# EAGLE design hover (EAGLE 8.3.2)
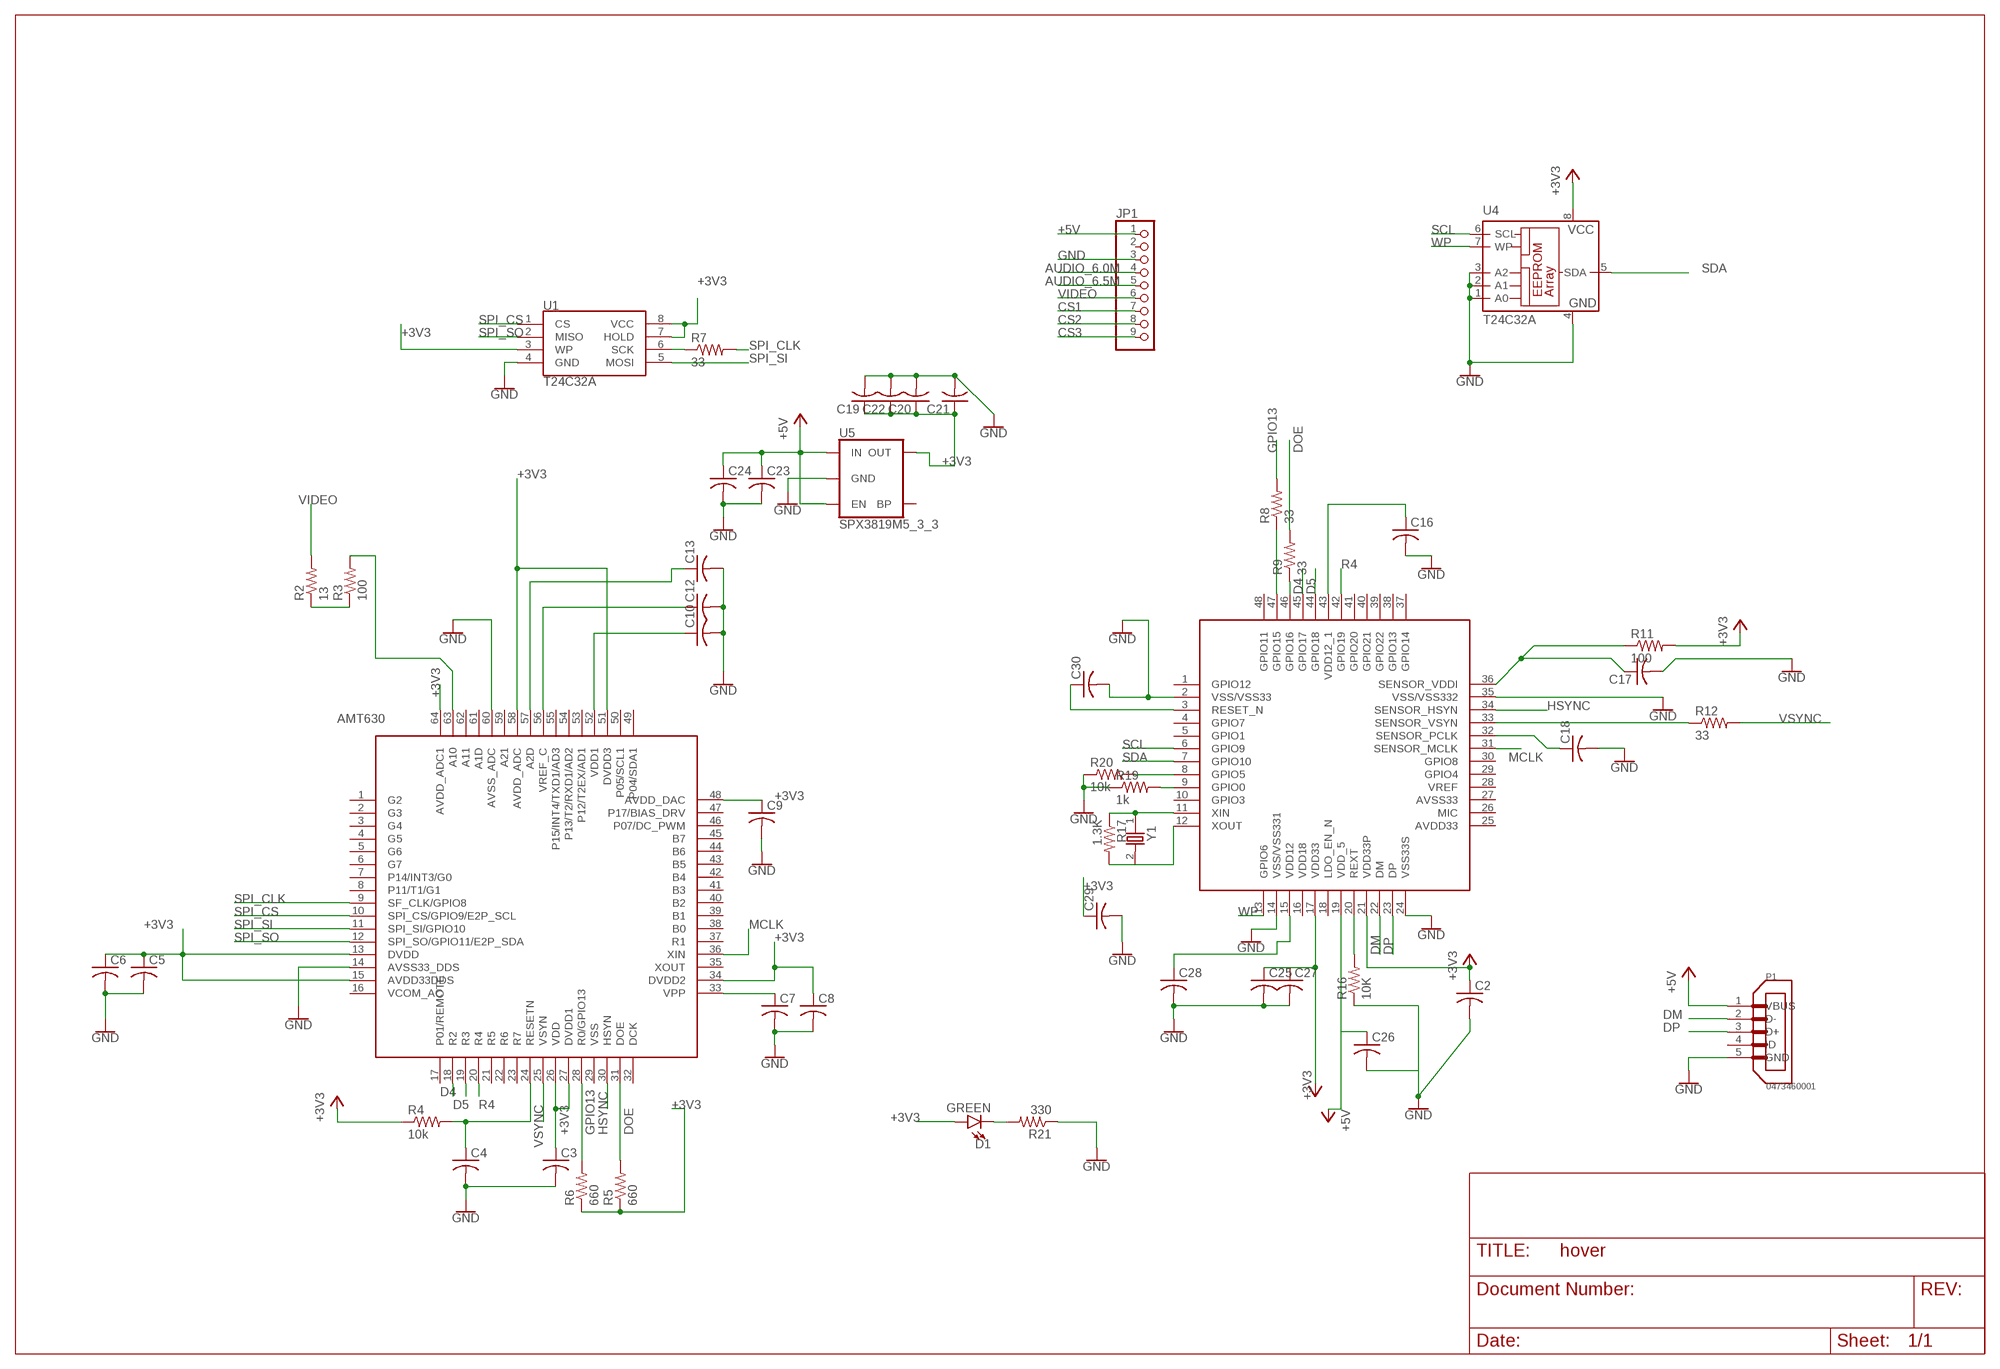
[diagram p0: schematic, sheet 1]

## Parts
C2  C-USC0402  [C0402]
C3  C-USC0402  [C0402]
C4  C-USC0402  [C0402]
C5  C-USC0402  [C0402]
C6  C-USC0402  [C0402]
C7  C-USC0402  [C0402]
C8  C-USC0402  [C0402]
C9  C-USC0402  [C0402]
C10  C-USC0402  [C0402]
C12  C-USC0402  [C0402]
C13  C-USC0402  [C0402]
C16  C-USC0402  [C0402]
C17  C-USC0402  [C0402]
C18  C-USC0402  [C0402]
C19  C-USC0402  [C0402]
C20  C-USC0402  [C0402]
C21  C-USC0402  [C0402]
C22  C-USC0402  [C0402]
C23  C-USC0402  [C0402]
C24  C-USC0402  [C0402]
C25  C-USC0402  [C0402]
C26  C-USC0402  [C0402]
C27  C-USC0402  [C0402]
C28  C-USC0402  [C0402]
C29  C-USC0402  [C0402]
C30  C-USC0402  [C0402]
D1  GREEN  LED-GREEN0603  [LED-0603]
JP1  PINHD-1X9  [1X09-BIG]
P1  0473460001  [MOLEX_0473460001]
R2  13  R-US_R0402  [R0402]
R3  100  R-US_R0402  [R0402]
R4  10k  R-US_R0402  [R0402]
R5  660  R-US_R0402  [R0402]
R6  660  R-US_R0402  [R0402]
R7  33  R-US_R0402  [R0402]
R8  33  R-US_R0402  [R0402]
R9  33  R-US_R0402  [R0402]
R11  100  R-US_R0402  [R0402]
R12  33  R-US_R0402  [R0402]
R16  10K  R-US_R0402  [R0402]
R17  1.3K  R-US_R0402  [R0402]
R19  1k  R-US_R0402  [R0402]
R20  10k  R-US_R0402  [R0402]
R21  330  R-US_R0402  [R0402]
U1  T24C32A  SPI_FLASH-X25XXSMD1  [SO08-EIAJ]
U2  V399  [LQFP48]
U3  AMT630  [QFP50P1200X1200X160-64N]
U4  T24C32A  [SOIC127P600X175-8N]
U5  SPX3819M5_3_3  V_REG_SPX3819-SOT23-5  [SOT23-5]
Y1  ABM3-27.000MHZ-B2-T  [XTAL500X320X130N]

## Nets
+3V3: C2.1 C3.1 C5.1 C6.1 C8.1 C9.1 C19.1 C20.1 C21.1 C22.1 C25.1 C27.1 C29.1 D1.A R4.1 R5.1 R6.1 R11.2 U1.3(WP) U1.7(HOLD) U1.8(VCC) U2.17(VDD33) U2.21(VDD33P) U3.13(DVDD) U3.15(AVDD33DDS) U3.26(VDD) U3.27(DVDD1) U3.34(DVDD2) U3.48(AVDD_DAC) U3.51(DVDD3) U3.58(AVDD_ADC) U3.64(AVDD_ADC1) U4.8(VCC) U5.5(OUT)
+5V: C23.1 C24.1 C26.1 JP1.1 P1.1(VBUS) U2.19(VDD_5) U5.1(IN) U5.3(EN)
AUDIO_6.0M: JP1.4
AUDIO_6.5M: JP1.5
CS1: JP1.7
CS2: JP1.8
CS3: JP1.9
D4: U2.45(GPIO17) U3.18(R2)
D5: U2.44(GPIO18) U3.19(R3)
DM: P1.2(D-) U2.22(DM)
DOE: R5.2 R9.2 U3.31(DOE)
DP: P1.3(D+) U2.23(DP)
GND: C2.2 C3.2 C4.2 C5.2 C6.2 C7.2 C8.2 C9.2 C10.2 C12.2 C13.2 C16.2 C17.2 C18.2 C19.2 C20.2 C21.2 C22.2 C23.2 C24.2 C25.2 C26.2 C27.2 C28.2 C29.2 C30.2 JP1.3 P1.5(GND) R16.1 R19.1 R20.1 R21.1 U1.4(GND) U2.2(VSS/VSS33) U2.14(VSS/VSS331) U2.24(VSS33S) U2.35(VSS/VSS332) U3.14(AVSS33_DDS) U3.60(AVSS_ADC) U4.1(A0) U4.2(A1) U4.3(A2) U4.4(GND) U5.2(GND)
GPIO13: R6.2 R8.2 U3.28(R0/GPIO13)
HSYNC: U2.34(SENSOR_HSYN) U3.30(HSYN)
MCLK: U2.31(SENSOR_MCLK) U3.36(XIN)
N$1: C4.1 R4.2 U3.24(RESETN)
N$2: R2.1 R3.1
N$3: R8.1 U2.47(GPIO15)
N$4: C16.1 U2.43(VDD12_1)
N$5: C7.1 U3.33(VPP)
N$6: C12.1 U3.56(VREF_C)
N$7: C13.1 U3.57(A2D)
N$8: C10.1 U3.52(VDD1)
N$9: R7.1 U1.6(SCK)
N$10: R20.2 U2.8(GPIO5)
N$11: R19.2 U2.9(GPIO0)
N$12: R16.2 U2.20(REXT)
N$13: R17.1 U2.11(XIN) Y1.1
N$14: R17.2 U2.12(XOUT) Y1.2
N$15: R9.1 U2.46(GPIO16)
N$16: R12.1 U2.33(SENSOR_VSYN)
N$17: C18.1 U2.32(SENSOR_PCLK)
N$18: D1.C R21.2
N$19: C30.1 U2.3(RESET_N)
N$20: C28.1 U2.15(VDD12)
N$21: R3.2 U3.63(A10)
N$24: C17.1 R11.1 U2.36(SENSOR_VDDI)
R4: U2.42(GPIO19) U3.20(R4)
SCL: U2.6(GPIO9) U4.6(SCL)
SDA: U2.7(GPIO10) U4.5(SDA)
SPI_CLK: R7.2 U3.9(SF_CLK/GPIO8)
SPI_CS: U1.1(CS) U3.10(SPI_CS/GPIO9/E2P_SCL)
SPI_SI: U1.5(MOSI) U3.11(SPI_SI/GPIO10)
SPI_SO: U1.2(MISO) U3.12(SPI_SO/GPIO11/E2P_SDA)
VIDEO: JP1.6 R2.2
VSYNC: R12.2 U3.25(VSYN)
WP: U2.13(GPIO6) U4.7(WP)
Unconnected: JP1.2 P1.4(ID) U2.1(GPIO12) U2.4(GPIO7) U2.5(GPIO1) U2.10(GPIO3) U2.16(VDD18) U2.18(LDO_EN_N) U2.25(AVDD33) U2.26(MIC) U2.27(AVSS33) U2.28(VREF) U2.29(GPIO4) U2.30(GPIO8) U2.37(GPIO14) U2.38(GPIO13) U2.39(GPIO22) U2.40(GPIO21) U2.41(GPIO20) U2.48(GPIO11) U3.1(G2) U3.2(G3) U3.3(G4) U3.4(G5) U3.5(G6) U3.6(G7) U3.7(P14/INT3/G0) U3.8(P11/T1/G1) U3.16(VCOM_AC) U3.17(P01/REMOTE) U3.21(R5) U3.22(R6) U3.23(R7) U3.29(VSS) U3.32(DCK) U3.35(XOUT) U3.37(R1) U3.38(B0) U3.39(B1) U3.40(B2) U3.41(B3) U3.42(B4) U3.43(B5) U3.44(B6) U3.45(B7) U3.46(P07/DC_PWM) U3.47(P17/BIAS_DRV) U3.49(P04/SDA1) U3.50(P05/SCL1) U3.53(P12/T2EX/AD1) U3.54(P13/T2/RXD1/AD2) U3.55(P15/INT4/TXD1/AD3) U3.59(A21) U3.61(A1D) U3.62(A11) U5.4(BP)

## Library data of the parts
C2-C10 C12 C13 C16-C30 = rcl:C-US: CAPACITOR, American symbol
D1 = SparkFun-LED:LED-GREEN: Green SMD LED Used in manufacturing of various products at SparkFun Packages: 0603 - SMD 0603 package [Product Link] <http://www.futureelectronics.com/en/technologies/semiconductors/optoelectronics/leds/Pages/9894312-LTST-C190GKT.aspx?CrossPart=HSMG-C190&IM=0> LilyPad 1206 - SMD1206 LilyPad package [Product Link] <http://www.futureelectronics.com/en/Technologies/Product.aspx?ProductID=IN150NGHARVATEKCORPORATION2049943&IM=0> 1206 - SMD1206 package [Product Link] <http://www.futureelectronics.com/en/technologies/semiconductors/optoelectronics/leds/Pages/8315665-LTST-C150KGKT.aspx?IM=0> 1206 Bottom Mount -SMD 1206 Bottom Mount [Product Link] <http://www.digikey.com/product-detail/en/lite-on-inc/LTST-C230KGKT/160-1456-1-ND/386854> SparkFun Products: Pro Mini 328 -5V <https://www.sparkfun.com/products/821> RedBoard <https://www.sparkfun.com/products/12757> MP3 Trigger <https://www.sparkfun.com/products/13720> Makey Makey <https://www.sparkfun.com/products/11076>; PROD_ID: DIO-00821
JP1 = adafruit:PINHD-1X9: Pin header 1x10 0.1" spacing With round pins
P1 = 0473460001:0473460001: Conn Micro USB Type B RCP 5 POS 0.65mm Solder RA SMD 5 Terminal 1 Port T/R; AVAILABILITY: Good; DESCRIPTION: DEK 5 FW 1-50. Terminal markers, Card, 5 x 5 mm, Polyamide, Colour: White GTIN (EAN): 4008190135157; MF: Weidmuller; MP: 0473460001; PACKAGE: None; PRICE: 2.87 USD
R2-R9 R11 R12 R16 R17 R19-R21 = rcl:R-US_: RESISTOR, American symbol
U1 = SparkFun-IC-Memory:SPI_FLASH-X25XX: 32M Serial Flash Memory 8pin SPI Flash series x25xx. Works with devices like W25X32 and BR25L32 Datasheet <http://www.macronix.com/Lists/Datasheet/Attachments/5031/MX25L3206E,%203V,%2032Mb,%20v1.5.pdf> SparkFun Products SparkFun Venus GPS Logger <https://www.sparkfun.com/products/10920> (GPS-10920); PROD_ID: IC-09109; VALUE: 25F32006WSOI
U2 = v399:V399
U3 = amt630:AMT630
U4 = SOIC127P600X175-8N:T24C32A
U5 = SparkFun-IC-Power:V_REG_SPX3819: SPX3819 Voltage Regulator 3.3V 500mA, 16V input Datasheet <https://www.exar.com/content/document.ashx?id=22106> SparkFun Products: SparkFun Serial Controlled Motor Driver <https://www.sparkfun.com/products/13911>; PROD_ID: VREG-13321
Y1 = ABM3-27.000MHZ-B2-T:ABM3-27.000MHZ-B2-T: Crystals 12MHz 18pF 30ppm -40C +85C; AVAILABILITY: Good; DESCRIPTION: Crystal 27MHz ?Ø¢Â±20ppm (Tol) ?Ø¢Â±50ppm (Stability) 18pF FUND 50Ohm 2-Pin CSMD T/R; MF: Abracon; MP: ABM3-27.000MHZ-B2-T; PACKAGE: SMD-2 Abracon; PRICE: 0.59 USD

## Board
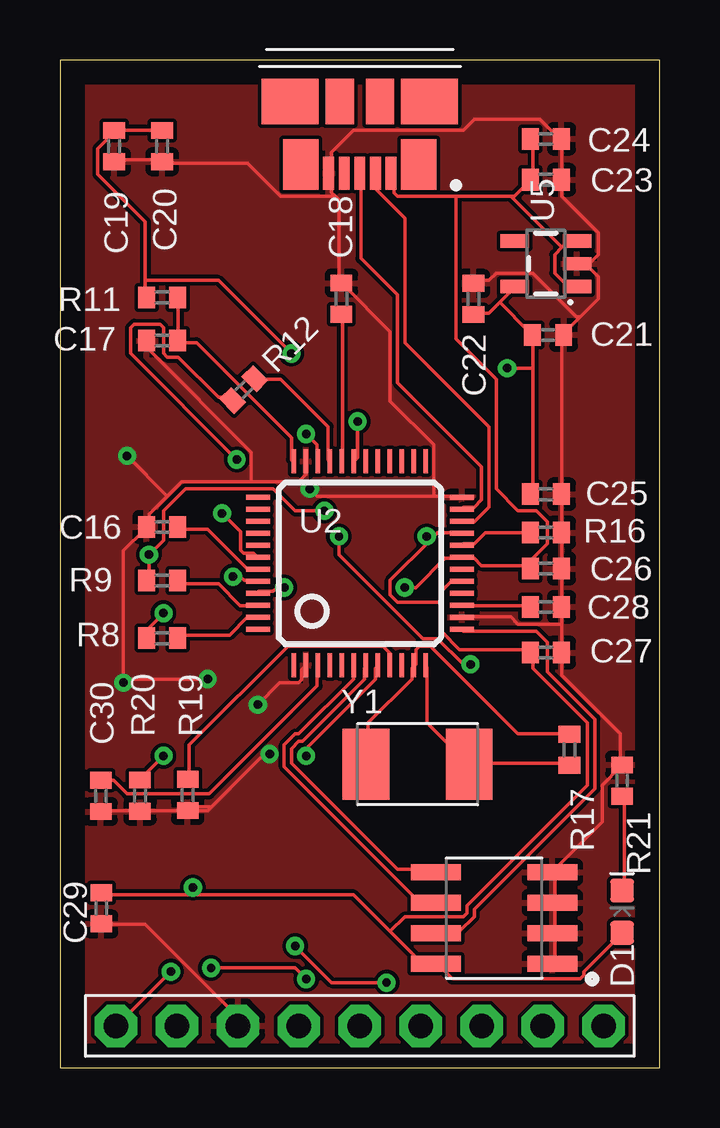
[diagram p1: board, top side]
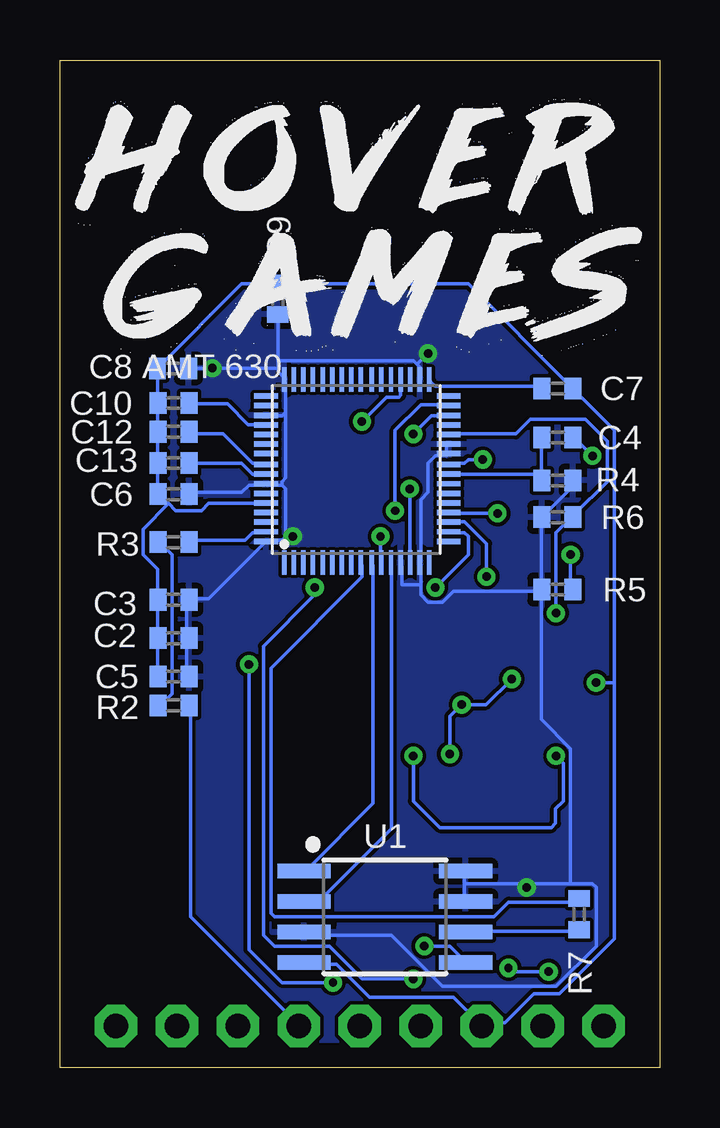
[diagram p2: board, bottom side, seen from below]

Size 25 x 42 mm. Coordinates in mm from the lower left corner, seen from the top.
Outline: 25,0 25,42 0,42 0,0 25,0
Copper layers (1*16): Top 0.035mm / dielectric 1.5mm / Bottom 0.035mm
Design rules "default": minimum track width 6mil, minimum drill 0.35mm, track to track 6mil, track to pad 6mil, pad to pad 6mil, via to via 6mil, smd to smd 6mil, copper to edge 40mil, drill to drill 6mil, minimum pad ring 10mil, minimum via ring 8mil, stop-mask expansion 4mil, vias tented up to drill 0mil, thermal gap 10mil

### Footprints (pad centres in the part's own frame; a part is rotated, then mirrored left to right if it is on the bottom)
C0402 = smd 0.7 x 0.9: 1 -0.65,0; 2 0.65,0
LED-0603 = smd 1 x 1: A -0.877,0; C 0.877,0
1X09-BIG = drill 1.016 pad 1.778 octagon: 1 -10.16,0; 2 -7.62,0; 3 -5.08,0; 4 -2.54,0; 5 0,0; 6 2.54,0; 7 5.08,0; 8 7.62,0; 9 10.16,0
MOLEX_0473460001 = smd 0.45 x 1.38: 1 -1.3,0; 2 -0.65,0; 3 0,0; 4 0.65,0; 5 1.3,0 | smd 1.475 x 2.1: P1 -2.462,-0.36; P2 2.462,-0.36 | smd 2.375 x 1.9: P3 -2.913,-2.99; P6 2.913,-2.99 | smd 1.175 x 1.9: P4 -0.838,-2.99; P5 0.838,-2.99
R0402 = smd 0.7 x 0.9: 1 -0.65,0; 2 0.65,0
SO08-EIAJ = smd 0.61 x 2.21: 1 -1.905,-3.378; 2 -0.635,-3.378; 3 0.635,-3.378; 4 1.905,-3.378; 5 1.905,3.353; 6 0.635,3.353; 7 -0.635,3.353; 8 -1.905,3.353
LQFP48 = smd 0.2 x 1: 1 -2.75,-4.25; 2 -2.25,-4.25; 3 -1.75,-4.25; 4 -1.25,-4.25; 5 -0.75,-4.25; 6 -0.25,-4.25; 7 0.25,-4.25; 8 0.75,-4.25; 9 1.25,-4.25; 10 1.75,-4.25; 11 2.25,-4.25; 12 2.75,-4.25; 25 2.75,4.25; 26 2.25,4.25; 27 1.75,4.25; 28 1.25,4.25; 29 0.75,4.25; 30 0.25,4.25; 31 -0.25,4.25; 32 -0.75,4.25; 33 -1.25,4.25; 34 -1.75,4.25; 35 -2.25,4.25; 36 -2.75,4.25 | smd 1 x 0.2: 13 4.25,-2.75; 14 4.25,-2.25; 15 4.25,-1.75; 16 4.25,-1.25; 17 4.25,-0.75; 18 4.25,-0.25; 19 4.25,0.25; 20 4.25,0.75; 21 4.25,1.25; 22 4.25,1.75; 23 4.25,2.25; 24 4.25,2.75; 37 -4.25,2.75; 38 -4.25,2.25; 39 -4.25,1.75; 40 -4.25,1.25; 41 -4.25,0.75; 42 -4.25,0.25; 43 -4.25,-0.25; 44 -4.25,-0.75; 45 -4.25,-1.25; 46 -4.25,-1.75; 47 -4.25,-2.25; 48 -4.25,-2.75
QFP50P1200X1200X160-64N = smd 0.2 x 0.998: 1 0.502,-0.381; 2 0.901,-0.381; 3 1.301,-0.381; 4 1.701,-0.381; 5 2.101,-0.381; 6 2.501,-0.381; 7 2.9,-0.381; 8 3.3,-0.381; 9 3.7,-0.381; 10 4.154,-0.381; 11 4.554,-0.381; 12 4.954,-0.381; 13 5.353,-0.381; 14 5.753,-0.381; 15 6.153,-0.381; 16 6.553,-0.381; 33 6.553,7.239; 34 6.153,7.239; 35 5.753,7.239; 36 5.353,7.239; 37 4.954,7.239; 38 4.554,7.239; 39 4.154,7.239; 40 3.7,7.239; 41 3.3,7.239; 42 2.9,7.239; 43 2.501,7.239; 44 2.101,7.239; 45 1.701,7.239; 46 1.301,7.239; 47 0.901,7.239; 48 0.502,7.239 | smd 0.998 x 0.2: 17 7.366,0.502; 18 7.366,0.901; 19 7.366,1.301; 20 7.366,1.701; 21 7.366,2.101; 22 7.366,2.501; 23 7.366,2.9; 24 7.366,3.3; 25 7.366,3.7; 26 7.366,4.154; 27 7.366,4.554; 28 7.366,4.954; 29 7.366,5.353; 30 7.366,5.753; 31 7.366,6.153; 32 7.366,6.553; 49 -0.254,6.553; 50 -0.254,6.153; 51 -0.254,5.753; 52 -0.254,5.353; 53 -0.254,4.954; 54 -0.254,4.554; 55 -0.254,4.154; 56 -0.254,3.7; 57 -0.254,3.3; 58 -0.254,2.9; 59 -0.254,2.501; 60 -0.254,2.101; 61 -0.254,1.701; 62 -0.254,1.301; 63 -0.254,0.901; 64 -0.254,0.502
SOIC127P600X175-8N = smd 2.07 x 0.66: 1 -2.425,1.905; 2 -2.425,0.635; 3 -2.425,-0.635; 4 -2.425,-1.905; 5 2.425,-1.905; 6 2.425,-0.635; 7 2.425,0.635; 8 2.425,1.905
SOT23-5 = smd 0.55 x 1.2: 1 -0.95,-1.3; 2 0,-1.3; 3 0.95,-1.3; 4 0.95,1.3; 5 -0.95,1.3
XTAL500X320X130N = smd 1.95 x 2.95: 1 -2.15,0; 2 2.15,0

### Placement (x,y rotation side)
C2  20.26,17.91 180 bottom
C3  20.26,19.51 180 bottom
C4  4.26,26.27 0 bottom
C5  20.26,16.31 180 bottom
C6  20.26,23.91 180 bottom
C7  4.26,28.31 0 bottom
C8  20.29,29.15 180 bottom
C9  15.92,32.05 90 bottom
C10  20.26,27.71 180 bottom
C12  20.26,26.51 180 bottom
C13  20.26,25.21 180 bottom
C16  4.26,22.54 180 top
C17  4.26,30.31 180 top
C18  11.74,32.05 90 top
C19  2.26,38.41 270 top
C20  4.26,38.41 270 top
C21  20.35,30.54 0 top
C22  17.24,32.04 90 top
C23  20.26,37.01 0 top
C24  20.26,38.71 0 top
C25  20.26,23.91 0 top
C26  20.26,20.81 0 top
C27  20.26,17.31 0 top
C28  20.26,19.21 0 top
C29  1.73,6.65 270 top
C30  1.71,11.33 270 top
D1  23.44,6.52 90 top
JP1  12.5,1.75 0 top
P1  12.5,37.29 180 top
R2  20.26,15.11 0 bottom
R3  20.26,21.91 0 bottom
R4  4.26,24.48 180 bottom
R5  4.26,19.94 0 bottom
R6  4.26,22.95 0 bottom
R7  3.35,6.41 90 bottom
R8  4.26,17.91 180 top
R9  4.26,20.31 180 top
R11  4.26,32.11 180 top
R12  7.66,28.27 225 top
R16  20.26,22.31 180 top
R17  21.24,13.26 270 top
R19  5.33,11.38 90 top
R20  3.34,11.35 90 top
R21  23.44,11.98 270 top
U1  11.44,6.3 270 bottom
U2  12.5,21.03 0 top
U3  16.15,21.44 0 bottom
U4  18.1,6.25 180 top
U5  20.26,33.51 90 top
Y1  14.92,12.66 0 top

### Tracks (layer width: path | path; a pad name or v marks a point on that pad's centre or on a via)
+3V3  (via drill 0.35)
  Top 0.152: 18.34,31.91 18.95,32.51 U5.5 | 18.34,31.91 17.88,31.45 17.27,31.45 C22.1 | 19.71,29.16 19.71,30.53 C21.1 19.56,30.69 18.34,31.91 | 19.71,29.16 19.71,23.98 C6.1 | C20.1 4.17,39.07 2.34,39.07 C19.1 2.19,38.92 1.58,38.31 1.58,37.24 3.56,35.26 3.56,32.82 | 3.56,32.82 3.56,32.21 R11.2 | 3.56,32.82 6.61,32.82 v9.65,29.77 | v18.65,29.16 19.71,29.16 | 15.9,19.41 15.9,19.87 16.36,20.32 16.66,20.32 U2.17 | 15.9,19.41 15.9,18.19 16.66,17.43 19.56,17.43 C27.1 19.71,17.27 19.71,16.67 22,14.38 22,11.79 16.97,6.76 16.97,6.45 16.82,6.3 14.38,6.3 13.77,5.69 | 15.44,22 13.77,20.32 13.77,19.71 14.07,19.41 15.9,19.41 | 15.44,22 15.75,22.3 16.66,22.3 U2.21 | 5.54,7.22 12.24,7.22 13.77,5.69 | 5.54,7.22 1.73,7.22 C29.1 | 13.77,5.69 14.99,4.47 15.6,4.47 U4.8 15.75,4.32 16.36,3.71 21.69,3.71 21.85,3.86 21.85,4.02 23.37,5.54 D1.A | 5.54,7.22 v5.54,7.52 | 15.44,22 v15.29,22.15
  Bottom 0.152: C5.1 19.71,16.36 19.71,17.88 C2.1 19.71,18.04 19.71,19.41 C3.1 19.56,19.56 18.8,19.56 16.51,21.85 U3.64 16.36,22 15.75,22 15.6,22.15 | C6.1 19.56,23.98 17.43,23.98 17.12,24.29 16.51,24.29 U3.58 16.36,24.29 15.75,24.29 | 15.6,22.15 15.6,24.13 15.75,24.29 | 15.9,29.16 15.9,29.01 15.6,28.7 U3.48 15.6,28.55 15.6,27.33 | 15.9,29.16 15.9,29.47 | 15.9,29.47 15.9,31.3 C9.1 | 15.9,29.16 v18.65,29.16 19.56,29.16 C8.1 | 10.11,29.31 10.26,29.47 15.9,29.47 | 10.11,29.31 9.96,29.16 9.96,28.7 U3.34 | 15.6,27.33 15.75,27.18 16.36,27.18 U3.51 | 10.11,29.31 v9.65,29.77 | 15.75,24.29 15.75,24.44 15.6,24.59 15.6,27.33 | R4.1 3.71,24.44 3.71,24.13 4.78,23.07 R6.1 4.93,22.91 4.93,20.02 R5.1 4.93,19.87 | U3.27 8.89,25.96 8.89,25.66 U3.26 8.89,25.5 9.35,25.5 9.65,25.2 9.65,23.98 9.96,23.68 9.96,21.08 U3.15 9.96,20.93 9.96,20.14 | 4.93,19.87 8.59,19.87 9.04,19.41 9.65,19.41 9.96,19.71 9.96,20.14 | 8.13,7.67 8.13,8.13 U1.8 | 8.13,7.67 8.13,7.06 U1.7 | 8.13,7.67 5.54,7.67 | 5.54,7.67 3.71,7.67 | 3.71,7.67 2.8,7.67 2.64,7.52 2.64,5.08 4.32,3.41 9.04,3.41 11.18,5.54 14.68,5.54 U1.3 | 4.93,19.87 4.93,14.53 3.71,13.31 3.71,7.67 | v5.54,7.52 5.54,7.67 | v15.29,22.15 15.6,22.15 | 9.96,20.14 10.74,20.14 10.74,20.89 U3.13
  pour Bottom: 0.17,41.86 0.17,0.11 0.19,0.1 24.85,0.1 24.88,0.13 24.88,41.86
+5V  (via drill 0.35)
  Top 0.152: 20.93,34.19 21.08,34.34 21.54,34.34 U5.3 | 20.93,34.19 20.63,33.89 20.63,33.12 21.08,32.67 21.54,32.67 U5.1 | C24.1 19.71,38.61 19.71,37.09 C23.1 19.56,36.93 18.95,36.32 18.8,36.32 | 18.8,36.32 16.51,36.32 | 16.51,36.32 14.07,36.32 13.92,36.48 13.92,37.24 P1.1 | 18.8,36.32 20.93,34.19 | 16.51,36.32 16.51,30.38 18.19,28.7 18.19,24.13 19.1,23.22 19.86,23.22 20.32,22.76 20.32,21.85 19.71,21.24 19.71,20.93 C26.1 19.56,20.93 17.58,20.93 17.27,21.24 16.82,21.24 U2.19 16.66,21.24 16.05,21.24 14.84,20.02 v14.38,20.02 | v4.62,4.02 2.49,1.88 JP1.1 | v6.3,4.17 9.81,4.17 v10.26,3.71
  Bottom 0.152: v4.62,4.02 6.15,4.02 v6.3,4.17 | v10.26,3.71 12.4,3.71 13.77,5.08 16.05,5.08 16.51,5.54 16.51,17.58 14.38,19.71 v14.38,20.02
D4  (via drill 0.35)
  Top 0.152: v9.35,20.02 9.04,20.02 8.89,19.87 8.28,19.87 U2.45
  Bottom 0.152: v9.35,20.02 7.98,21.39 7.98,22.15 8.13,22.3 8.74,22.3 U3.18
D5  (via drill 0.35)
  Top 0.152: v7.22,20.48 7.52,20.48 7.67,20.32 8.13,20.32 U2.44
  Bottom 0.152: v7.22,20.48 7.22,21.85 8.13,22.76 8.74,22.76 U3.19
DM
  Top 0.152: U2.22 16.82,22.76 17.27,22.76 17.88,23.37 17.88,26.72 14.38,30.23 14.38,35.41 13.16,36.63 13.16,37.24 P1.2
DOE  (via drill 0.35)
  Top 0.152: R9.2 3.71,20.32 v3.71,21.39 4.32,22 4.32,23.22 5.23,24.13 8.89,24.13 9.81,23.22 v11.03,23.22
  Bottom 0.152: v3.71,21.39 3.71,20.02 R5.2 | v11.03,23.22 11.03,26.57 9.96,27.64 8.89,27.64 U3.31
DP
  Top 0.152: U2.23 16.82,23.37 17.27,23.37 17.58,23.68 17.58,25.05 14.07,28.55 14.07,32.21 12.55,33.73 12.55,37.24 P1.3
GND  (via drill 0.35)
  Top 0.152: C29.2 3.56,6 7.37,2.19 7.37,1.88 JP1.3 | 21.69,31.3 22.46,32.06 22.46,32.97 22,33.43 | 21.69,31.3 21.08,30.69 C21.2 20.93,30.53 20.93,23.98 C25.2 20.93,23.83 20.93,22.46 R16.1 20.93,22.3 20.93,20.93 C26.2 20.93,20.78 20.93,19.26 C28.2 20.93,19.1 20.93,18.49 | 22,33.43 21.69,33.43 U5.2 22,33.43 | 21.69,31.3 21.54,31.3 19.71,33.12 18.19,33.12 17.88,32.82 17.27,32.82 C22.2 | 22,33.43 22.46,33.89 22.46,34.8 20.93,36.32 20.93,36.93 C23.2 20.93,37.09 20.93,38.61 C24.2 20.78,38.76 20.02,39.53 17.27,39.53 16.82,39.07 12.24,39.07 11.33,38.15 11.33,37.39 P1.5 11.33,37.24 11.33,36.48 11.48,36.32 | 20.93,18.49 20.93,17.43 C27.2 20.93,17.27 20.93,16.36 23.37,13.92 23.37,12.7 R21.1 23.37,12.55 22.61,11.79 22.61,10.26 20.63,8.28 U4.4 20.63,8.13 20.63,6.91 U4.3 20.63,6.76 20.63,5.69 U4.2 20.63,5.54 20.63,4.47 U4.1 | 20.93,18.49 19.1,18.49 18.8,18.8 16.82,18.8 U2.14 | C30.2 1.73,10.72 3.25,10.72 R20.1 3.41,10.72 5.23,10.72 R19.1 | 10.26,16.67 U2.2 10.08,16.6 10.08,16.18 9.95,16.05 9.16,16.05 v8.25,15.14 | 5.39,10.87 R19.1 | C19.2 2.34,37.85 4.17,37.85 C20.2 4.32,37.7 7.82,37.7 9.2,36.32 11.48,36.32 | 11.48,36.32 11.63,36.17 11.63,32.82 C18.2 11.79,32.67 13.77,30.69 13.77,27.79 15.6,25.96 15.6,23.83 | 4.47,23.83 5.08,24.44 7.98,24.44 | 4.47,23.83 3.71,23.07 3.71,22.61 C16.2 3.56,22.46 2.64,21.54 2.64,16.09 | 9.96,24.44 7.98,24.44 | 9.96,24.44 10.26,24.74 10.26,25.2 U2.35 | 4.47,23.83 v2.8,25.5 | 7.98,24.44 7.98,25.66 3.71,29.92 3.71,30.23 C17.2 | 9.96,24.44 10.11,24.44 v10.42,24.13 10.72,23.83 15.6,23.83 | 15.6,23.83 16.66,23.83 U2.24 | 2.64,16.09 v2.64,16.06
  Top 0.152: v6.16,16.21 2.77,16.21 2.64,16.09 | 2.54,10.72 6.15,10.72 6.28,10.85 | 6.28,10.85 8.82,13.39 8.82,13.16 v8.74,13.08 | R19.1 5.49,10.89 6.24,10.89 6.28,10.85
  Bottom 0.152: U1.4 14.68,4.32 13.46,4.32 12.09,2.95 8.59,2.95 7.52,1.88 JP1.3 7.37,1.88 6.45,1.88 5.23,3.1 4.17,3.1 1.88,5.39 1.88,16.06 | C5.2 20.93,16.36 20.93,17.88 C2.2 20.93,18.04 20.93,19.41 C3.2 20.93,19.56 20.93,20.78 21.54,21.39 21.54,22.46 20.47,23.52 | 20.47,23.52 20.78,23.83 C25.2 20.93,23.98 20.93,25.2 C13.2 20.93,25.35 20.93,26.42 C12.2 20.93,26.57 20.93,27.64 C10.2 20.93,27.79 20.93,29.01 C8.2 20.93,29.16 17.43,32.67 16.05,32.67 C9.2 15.9,32.67 7.98,32.67 3.71,28.4 C7.2 3.56,28.25 1.88,26.57 1.88,16.06 | 20.47,23.52 20.17,23.22 19.1,23.22 18.8,23.52 16.51,23.52 U3.60 | v2.8,25.5 3.56,26.27 C4.2 | v10.42,24.13 10.42,21.08 U3.14 | v2.64,16.06 1.88,16.06 | v6.16,16.21 7.23,15.14 v8.25,15.14 8.74,14.65 v8.74,13.08
  pour Top: 0.22,41.78 0.22,0.21 24.77,0.21 24.79,0.22 24.79,41.78
GPIO13  (via drill 0.35)
  Top 0.152: v4.32,18.95 3.71,18.34 3.71,18.04 R8.2
  Bottom 0.152: v4.32,18.95 4.32,22.3 3.71,22.91 R6.2 3.56,23.07 2.19,24.44 2.19,26.11 3.1,27.03 5.39,27.03 6,26.42 8.74,26.42 U3.28
HSYNC  (via drill 0.35)
  Top 0.152: v10.26,26.42 10.72,25.96 10.72,25.35 U2.34
  Bottom 0.152: v10.26,26.42 9.5,27.18 8.89,27.18 U3.30
MCLK  (via drill 0.35)
  Top 0.152: v12.41,26.94 12.41,25.43 U2.31
  Bottom 0.152: v12.41,26.94 11.39,27.95 10.87,27.95 10.8,28.03 U3.36
N$1
  Bottom 0.152: 4.93,24.74 4.93,26.27 C4.1 | 4.93,24.74 4.93,24.59 R4.2 4.93,24.74 | 4.93,24.74 8.74,24.74 U3.24
N$2
  Bottom 0.152: R2.1 20.78,15.14 20.32,15.6 20.32,21.39 20.78,21.85 R3.1
N$3
  Top 0.152: R8.1 4.93,18.04 7.06,18.04 7.82,18.8 8.13,18.8 U2.47
N$4
  Top 0.152: C16.1 4.93,22.46 6.15,22.46 7.82,20.78 8.13,20.78 U2.43
N$5
  Bottom 0.152: C7.1 4.93,28.4 9.35,28.4 9.5,28.55 U3.33
N$6
  Bottom 0.152: C12.1 19.56,26.42 18.19,26.42 16.97,25.2 16.51,25.2 U3.56
N$7
  Bottom 0.152: C13.1 19.56,25.2 17.43,25.2 16.97,24.74 16.51,24.74 U3.57
N$8
  Bottom 0.152: U3.52 17.15,26.8 18.02,27.67 19.57,27.67 C10.1
N$9
  Bottom 0.152: R7.1 3.41,5.69 7.98,5.69 U1.6
N$10  (via drill 0.35)
  Top 0.152: v4.32,13.01 3.41,12.09 R20.2 | U2.8 13.16,16.67 13.16,16.21 10.26,13.31 v10.26,13.01
  Bottom 0.152: v10.26,13.01 10.26,11.12 9.17,10.02 4.5,10.02 4.33,10.19 4.33,10.8 4.01,11.12 4.01,12.7 v4.32,13.01
N$11
  Top 0.152: R19.2 5.39,12.09 5.39,13.46 9.5,17.58 13.46,17.58 13.77,17.27 13.77,16.82 U2.9
N$12
  Top 0.152: R16.2 19.56,22.3 17.73,22.3 17.27,21.85 16.82,21.85 U2.20
N$13
  Top 0.152: R17.1 21.24,13.92 19.1,13.92 15.44,17.58 14.99,17.58 14.84,17.43 14.84,16.82 U2.11 14.68,16.67 14.68,16.21 12.85,14.38 12.85,12.7 Y1.1
N$14
  Top 0.152: R17.2 21.24,12.7 17.12,12.7 Y1.2 16.97,12.7 15.29,14.38 15.29,16.67 U2.12
N$15
  Top 0.152: R9.1 4.93,20.17 6.61,20.17 7.52,19.26 8.13,19.26 U2.46
N$16
  Top 0.152: R12.1 8.13,28.7 9.2,28.7 11.18,26.72 11.18,25.35 U2.33
N$17
  Top 0.152: C18.1 11.79,31.3 11.79,25.35 U2.32
N$18
  Top 0.152: R21.2 23.52,11.18 23.52,7.52 D1.C
N$19
  Top 0.152: 2.06,11.98 C30.1 2.23,11.98 2.8,11.42 6.22,11.42 10.72,15.92 10.72,16.74 U2.3
N$20
  Top 0.152: C28.1 19.56,19.26 16.82,19.26 U2.15
N$21
  Bottom 0.152: R3.2 19.56,22 17.27,22 16.97,22.3 16.51,22.3 U3.63
N$24
  Top 0.152: R11.1 4.93,32.06 4.93,30.38 C17.1 4.93,30.23 5.69,30.23 9.65,26.27 9.65,25.35 U2.36
R4  (via drill 0.35)
  Top 0.152: v6.76,23.11 7.52,22.34 7.52,21.58 7.66,21.45 8.08,21.45 U2.42
  Bottom 0.152: v6.76,23.11 8.75,23.11 U3.20
SCL
  Top 0.152: U2.6 12.24,16.67 12.24,16.21 9.96,13.92 9.81,13.92 9.35,13.46 9.35,12.55 14.99,6.91 15.6,6.91 U4.6
SDA
  Top 0.152: U2.7 12.7,16.67 12.7,16.21 10.11,13.62 9.96,13.62 9.65,13.31 9.65,12.7 14.07,8.28 15.6,8.28 U4.5
SPI_CLK
  Bottom 0.152: R7.2 3.41,6.91 6.3,6.91 6.91,6.3 16.05,6.3 16.21,6.45 16.21,16.67 12.4,20.48 12.4,20.93 U3.9
SPI_CS
  Bottom 0.152: U3.10 11.94,20.93 11.94,11.03 14.68,8.28 U1.1
SPI_SI  (via drill 0.35)
  Top 0.152: v11.63,22.15 11.63,21.39 15.14,17.88 15.75,17.88 16.82,16.82 v17.12,16.82 | v13.62,3.56 11.33,3.56 v9.81,5.08
  Bottom 0.152: v11.63,22.15 11.63,21.08 U3.11 | v17.12,16.82 17.12,4.93 15.75,3.56 v13.62,3.56 | v9.81,5.08 8.74,5.08 8.13,4.47 U1.5
SPI_SO
  Bottom 0.152: U3.12 11.18,20.93 11.18,9.96 14.07,7.06 14.68,7.06 U1.2
VIDEO
  Bottom 0.152: R2.2 19.56,14.99 19.56,6.3 15.14,1.88 JP1.6
VSYNC  (via drill 0.35)
  Top 0.152: v7.37,25.35 2.95,29.77 2.95,30.84 3.1,30.99 4.17,30.99 4.32,30.84 4.32,29.77 4.47,29.62 4.93,29.62 6.61,27.94 7.06,27.94 R12.2
  Bottom 0.152: v7.37,25.35 7.98,25.35 8.13,25.2 8.74,25.2 U3.25
WP
  Top 0.152: U2.13 16.82,18.19 19.86,18.19 20.32,17.73 20.32,16.51 22.3,14.53 22.3,11.64 17.27,6.61 17.27,6.3 16.66,5.69 15.75,5.69 U4.7